# Altium schematic sheet УШЯИ687253.017Э3_3.SchDoc
size 420 x 297 mm; SheetNumber: 3; SheetTotal: 3
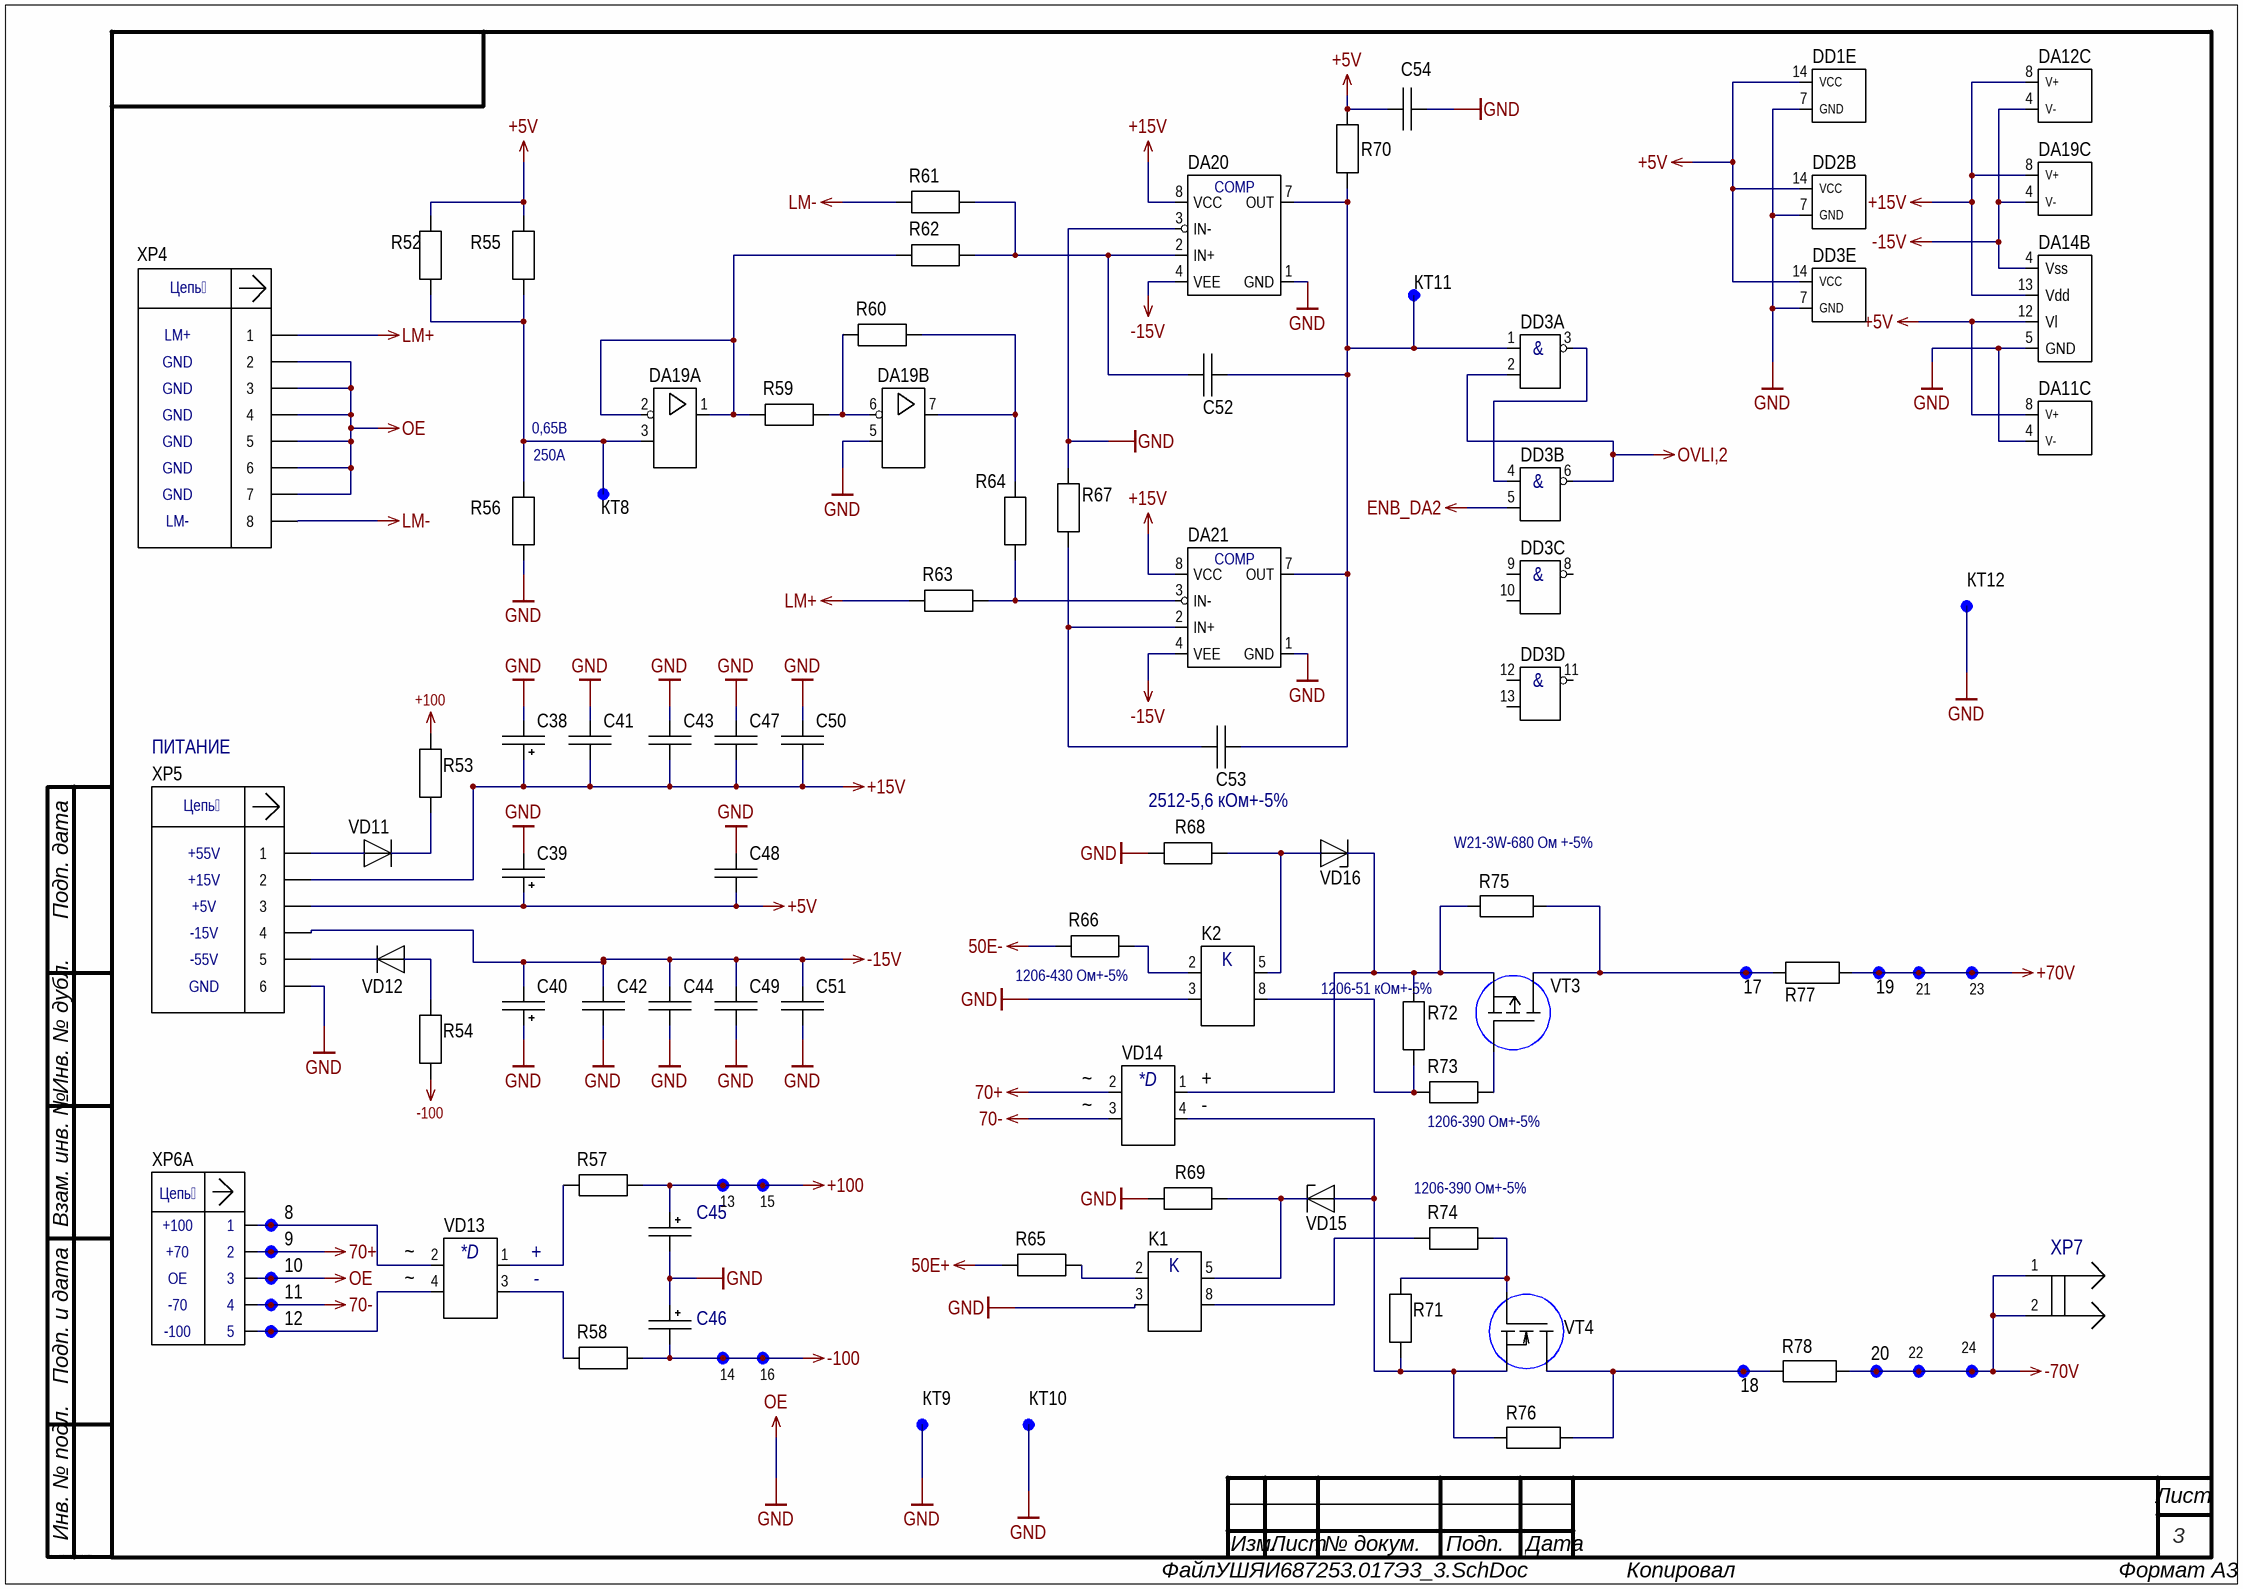
[diagram p0: УШЯИ687253.017Э3_3.SchDoc]

## Parts
8  OTV  (value not drawn)  (no BOM)
9  OTV  (value not drawn)  (no BOM)
10  OTV  (value not drawn)  (no BOM)
11  OTV  (value not drawn)  (no BOM)
12  OTV  (value not drawn)  (no BOM)
13  OTV13  [OTV13]  (value not drawn)  (no BOM)
14  OTV13  [OTV13]  (value not drawn)  (no BOM)
15  OTV13  [OTV13]  (value not drawn)  (no BOM)
16  OTV13  [OTV13]  (value not drawn)  (no BOM)
17  OTV  (value not drawn)  (no BOM)
18  OTV  (value not drawn)  (no BOM)
19  OTV  (value not drawn)  (no BOM)
20  OTV  (value not drawn)  (no BOM)
21  OTV13  [OTV13]  (value not drawn)  (no BOM)
22  OTV13  [OTV13]  (value not drawn)  (no BOM)
23  OTV13  [OTV13]  (value not drawn)  (no BOM)
24  OTV13  [OTV13]  (value not drawn)  (no BOM)
C38  ECR4R7M50B  [CAP TH ALUM ELEC D5.00mm S2.00mm H11.00mm]  (value not drawn)
C39  ECR4R7M50B  [CAP TH ALUM ELEC D5.00mm S2.00mm H11.00mm]  (value not drawn)
C40  ECR4R7M50B  [CAP TH ALUM ELEC D5.00mm S2.00mm H11.00mm]  (value not drawn)
C41  0805-X7R-25 В-0,33 мкФ +-10%  [CAP: 0805]  (value not drawn)
C42  0805-X7R-25 В-0,33 мкФ +-10%  [CAP: 0805]  (value not drawn)
C43  0805-X7R-25 В-0,33 мкФ +-10%  [CAP: 0805]  (value not drawn)
C44  0805-X7R-25 В-0,33 мкФ +-10%  [CAP: 0805]  (value not drawn)
C45  KM220M2EBKJ1020VBK  [CAP TH ALUM ELEC D10.00mm S5.00mm H20.00mm]  (value not drawn)
C46  KM220M2EBKJ1020VBK  [CAP TH ALUM ELEC D10.00mm S5.00mm H20.00mm]  (value not drawn)
C47  0805-X7R-25 В-0,33 мкФ +-10%  [CAP: 0805]  (value not drawn)
C48  0805-X7R-25 В-0,33 мкФ +-10%  [CAP: 0805]  (value not drawn)
C49  0805-X7R-25 В-0,33 мкФ +-10%  [CAP: 0805]  (value not drawn)
C50  0805-X7R-25 В-0,33 мкФ +-10%  [CAP: 0805]  (value not drawn)
C51  0805-X7R-25 В-0,33 мкФ +-10%  [CAP: 0805]  (value not drawn)
C52  1206-X7R-50 B-22 пФ+-10%  [CAP: 1206]  (value not drawn)
C53  1206-X7R-50 B-22 пФ+-10%  [CAP: 1206]  (value not drawn)
C54  0805-X7R-25 В-0,33 мкФ +-10%  [CAP: 0805]  (value not drawn)
DA11  ADA4084-2ARZ  [8-SOIC]  (value not drawn)  (part C of 3)
DA12  ADA4084-2ARZ  [8-SOIC]  (value not drawn)  (part C of 3)
DA14  ADG433BR  [16-SOIC]  (value not drawn)  (part B of 2)
DA19  ADA4084-2ARZ  [8-SOIC]  (value not drawn)  (parts A,B,C of 3)
DA20  IL311D  [8-SOIC]  (value not drawn)
DA21  IL311D  [8-SOIC]  (value not drawn)
DD1  IN74HC00AD  [14-soic]  (value not drawn)  (part E of 5)
DD2  IN74HC20D  [14-SOIC]  (value not drawn)  (part B of 2)
DD3  IN74HC00AD  [14-soic]  (value not drawn)  (parts A,B,C,D,E of 5)
K1  TLP3549F  [8-DIP]  (value not drawn)
K2  TLP3549F  [8-DIP]  (value not drawn)
R52  1206-15 кОм+-5%  [1206]  (value not drawn)
R53  1206-12 кОм+-5%  [1206]  (value not drawn)
R54  1206-12 кОм+-5%  [1206]  (value not drawn)
R55  1206-6,98 кОм+-1%  [1206]  (value not drawn)
R56  1206-1 кОм+-5%  [1206]  (value not drawn)
R57  2512-1,2 кОм+-5%  [2512]  (value not drawn)
R58  2512-1,2 кОм+-5%  [2512]  (value not drawn)
R59  1206-2 кОм+-0.5%  [1206]  (value not drawn)
R60  1206-2 кОм+-0.5%  [1206]  (value not drawn)
R61  1206-240 Ом+-5%  [1206]  (value not drawn)
R62  1206-240 Ом+-5%  [1206]  (value not drawn)
R63  1206-240 Ом+-5%  [1206]  (value not drawn)
R64  1206-240 Ом+-5%  [1206]  (value not drawn)
R65  1206-430 Ом+-5%  [1206]  (value not drawn)
R66  1206-430 Ом+-5%  [1206]
R67  1206-150 Ом+-5%  [1206]  (value not drawn)
R68  2512-5,6 кОм+-5%  [2512]
R69  2512-5,6 кОм+-5%  [2512]  (value not drawn)
R70  1206-2 кОм+-5%  [1206]  (value not drawn)
R71  1206-51 кОм+-5%  [1206]  (value not drawn)
R72  1206-51 кОм+-5%  [1206]
R73  1206-390 Ом+-5%  [1206]
R74  1206-390 Ом+-5%  [1206]
R75  W21-3W-680 Ом +-5%  [С2-33Н-0,25АИ (220.03.0401.00.00)]
R76  W21-3W-680 Ом +-5%  [С2-33Н-0,25АИ (220.03.0401.00.00)]  (value not drawn)
R77  HS15-4R7-J  [HS15]  (value not drawn)
R78  HS15-4R7-J  [HS15]  (value not drawn)
VD11  1N4007WS  [SOD-323]  (value not drawn)
VD12  1N4007WS  [SOD-323]  (value not drawn)
VD13  W04M  [WOM]  (value not drawn)
VD14  GSIB2540  [GSIB-5S]  (value not drawn)
VD15  BZT52C10  [SOD-123F]  (value not drawn)
VD16  BZT52C10  [SOD-123F]  (value not drawn)
VT3  IRF5210PBF  [TO-220(F)]  (value not drawn)
VT4  IPA083N10N5XKSA1  [TO-220(f)]  (value not drawn)
XP4  280373-2  [280373-2]  (value not drawn)
XP5  280372-2  [280372-2]  (value not drawn)
XP6  MNL-350810-1  [350810-1]  (value not drawn)  (part A of 3)
XP7  XT60-M  [AMASS_XT60-M]  (value not drawn)
КТ8  Лепесток  [LEPESTOK7750224]  (value not drawn)
КТ9  Лепесток  [LEPESTOK7750224]  (value not drawn)
КТ10  Лепесток  [LEPESTOK7750224]  (value not drawn)
КТ11  Лепесток  [LEPESTOK7750224]  (value not drawn)
КТ12  Лепесток  [LEPESTOK7750224]  (value not drawn)

## Nets
50E+: R65.1
50E-: R66.2
70+: 9.?1 VD14.2 XP6.2
70-: 11.?1 VD14.3 XP6.4
+5V: C39.1 C48.2 C54.1 DA11.8(V+) DA14.12(Vl) DD1.14(VCC) DD2.14(VCC) DD3.14(VCC) R52.2 R55.2 R70.2 XP5.3
+15V: C38.1 C41.1 C43.2 C47.2 C50.2 DA12.8(V+) DA14.13(Vdd) DA19.8(V+) DA20.8(VCC) DA21.8(VCC) XP5.2
+70V: 19.?1 21.1 23.1 R77.1
+100: 13.1 15.1 C45.1 R53.2 R57.2
-15V: C40.2 C42.1 C44.1 C49.1 C51.1 DA12.4(V-) DA14.4(Vss) DA19.4(V-) DA20.4(VEE) DA21.4(VEE) XP5.4
-70V: 20.?1 22.1 24.1 R78.2 XP7.1 XP7.2
-100: 14.1 16.1 C46.2 R54.2 R58.2
ENB_DA2: DD3.5(B2)
GND: 10.?1 C38.2 C39.2 C40.1 C41.2 C42.2 C43.1 C44.2 C45.2 C46.1 C47.1 C48.1 C49.2 C50.1 C51.2 C54.2 DA11.4(V-) DA14.5(GND) DA19.5(+IN_B) DA20.1(GND) DA20.3(IN-) DA21.1(GND) DD1.7(GND) DD2.7(GND) DD3.7(GND) K1.3(KATHODE) K2.3(KATHODE) R56.1 R67.2 R68.1 R69.1 XP4.2 XP4.3 XP4.4 XP4.5 XP4.6 XP4.7 XP5.6 XP6.3 КТ9.1 КТ10.1 КТ12.1  [also labelled OE]
LM+: R63.2 XP4.1
LM-: R61.1 XP4.8
OVLI,2: DD3.2(B1) DD3.6(Y2)
Net8_?1: 8.?1 VD13.2 XP6.1
Net12_?1: 12.?1 VD13.4 XP6.5
Net17_?1: 17.?1 R75.2 R77.2 VT3.2(D)
Net18_?1: 18.?1 R76.2 R78.1 VT4.2(D)
NetC52_1: C52.1 C53.2 DA20.7(OUT) DA21.7(OUT) DD3.1(A1) R70.1 КТ11.1
NetC52_2: C52.2 DA20.2(IN+) R61.2 R62.2
NetC53_1: C53.1 DA21.2(IN+) R67.1
NetDA19_1: DA19.1(OUT_A) DA19.2(-IN_A) R59.1 R62.1
NetDA19_3: DA19.3(+IN_A) R52.1 R55.1 R56.2 КТ8.1
NetDA19_6: DA19.6(-IN_B) R59.2 R60.1
NetDA19_7: DA19.7(OUT_B) R60.2 R64.2
NetDA21_3: DA21.3(IN-) R63.1 R64.1
NetDD3_3: DD3.3(Y1) DD3.4(A2)
NetK1_2: K1.2(ANOD) R65.2
NetK1_5: K1.5(DRAIN) R69.2 VD15.1(K)
NetK1_8: K1.8(DRAIN) R74.1
NetK2_2: K2.2(ANOD) R66.1
NetK2_5: K2.5(DRAIN) R68.2 VD16.2(A)
NetK2_8: K2.8(DRAIN) R72.1 R73.1
NetR53_1: R53.1 VD11.1
NetR54_1: R54.1 VD12.2
NetR57_1: R57.1 VD13.1(+)
NetR58_1: R58.1 VD13.3(-)
NetR71_1: R71.1 R76.1 VD14.4 VD15.2(A) VT4.3(S)
NetR71_2: R71.2 R74.2 VT4.1(G)
NetR72_2: R72.2 R75.1 VD14.1 VD16.1(K) VT3.3(S)
NetR73_2: R73.2 VT3.1(G)
NetVD11_2: VD11.2 XP5.1
NetVD12_1: VD12.1 XP5.5

Not connected (* = marked no-connect by the designer): DD3 8(Y3) 9(A3) 10(B3) 11(Y4) 12(A4) 13(B4)

## Notes on the sheet
- LM+
- GND
- 0,65В
- 250А
- LM-
- ПИТАНИЕ
- +55V
- +15V
- +5V
- -15V
- -55V
- (near VD14) ~
- (near VD14) +
- (near VD14) -
- +100
- +70
- OE
- (near XP6) 1
- (near XP6) 2
- (near XP6) 3
- (near VD13) ~
- (near VD13) -
- (near VD13) +
- -70
- -100
- (near XP6) 4
- (near XP6) 5
- Подп. дата
- Инв. № дубл.
- Взам. инв. №
- Подп. и дата
- Инв. № подл.
- Изм.
- Лист
- № докум.
- Подп.
- Дата
- ALTIUM GOSTBOM2.0 KEV
- Файл:
- Копировал
- Формат А3
- (in symbol 280372-2) Цепь
- (in symbol 280373-2) Цепь
- (in symbol GSIB2540) *D
- (in symbol IL311D) COMP
- (in symbol IN74HC00AD, part A) &
- (in symbol IN74HC00AD, part B) &
- (in symbol IN74HC00AD, part C) &
- (in symbol IN74HC00AD, part D) &
- (in symbol MNL-350810-1, part A) Цепь
- (in symbol TLP3549F) K
- (in symbol W04M) *D

## Library data of the parts
C38-C40 = ECR4R7M50B: Value: 4,7 мкФ
C45 C46 = KM220M2EBKJ1020VBK: KM220M2EBKJ1020VBK, 22uF, 105C,10x20; Value: *
C52 C53 = 1206-X7R-50 B-22 пФ+-10%: Value: 2,2 пФ
DA11 DA12 DA19 = ADA4084-2ARZ: 30 V, Low Noise, Rail-to-Rail Input/Output, / Low Power Operational Amplifiers
DA14 = ADG433BR_1: LC2MOS Precision Quad SPST Switches; Value: *
DA20 DA21 = IL311D: High Perfomance Voltage Comparartor; Value: *
DD1 DD3 = IN74HC00AD: Quad 2-Input NAND Gate High-Performance Silicon-Gate CMOS.
DD2 = IN74HC20D_1: Dual 4-input  NAND Gate CMOS
R52 = 1206-15 кОм+-5%: Value: 15 кОм; ModelPrint: 1206
R53 R54 = 1206-12 кОм+-5%: Value: 12 кОм; ModelPrint: 1206
R56 = 1206-1 кОм+-5%: Value: 1 кОм; ModelPrint: 1206
R57 R58 = 2512-1,2 кОм+-5%: Value: 1,2 кОм; ModelPrint: 2512
R59 R60 = 1206-2 кОм+-0.5%: Value: 2 кОм; ModelPrint: 1206
R61-R64 = 1206-240 Ом+-5%: Value: 240 Ом; ModelPrint: 1206
R65 R66 = 1206-430 Ом+-5%: Value: 430 Ом; ModelPrint: 1206
R67 = 1206-150 Ом+-5%: Value: 150 Ом; ModelPrint: 1206
R68 R69 = 2512-5,6 кОм+-5%: Value: 5,6 кОм; ModelPrint: 2512
R70 = 1206-2 кОм+-5%: Value: 2 кОм; ModelPrint: 1206
R71 R72 = 1206-51 кОм+-5%: Value: 51 кОм; ModelPrint: 1206
R73 R74 = 1206-390 Ом+-5%: Value: 390 Ом; ModelPrint: 1206
R75 R76 = W21-3W-680 Ом +-5%: Номинальная мощность рассеяния: 0,125 Вт; Диапазон значений номинальных сопротивлений: от 1 Ом до 3,01 МОм; Ряд сопротивлений: Е24, Е96; Категории качества: «ОТК»; ТУ: ОЖО.467.173 ТУ; Value: *
R77 R78 = HS15-4R7-J: Номинальная мощность рассеяния: 0,25 Вт; Диапазон значений номинальных сопротивлений: от 0,1 Ом до 3,01 МОм; Ряд сопротивлений: Е24, Е96; Категории качества: «ОТК»; ТУ: ОЖО.467.173 ТУ; Value: 4,7 Ом
VD11 VD12 = 1N4007WS: General Purpose Plastic Rectifier; Value: *
VD13 = W04M: Диод W04M
VD14 = GSIB2540: Диод GSIB2540
VD15 VD16 = BZT52C10: Стабилитрон BZT52C10; Value: *
VT4 = IPA083N10N5XKSA1: Single N-Channel 100 V 8.3 mOhm 37 nC OptiMOS Power Mosfet - TO-220-3
XP4 = 280373-2: Connector; System: Connector
XP5 = 280372-2: Connector; System: Connector
XP6 = MNL-350810-1: System: Connector
XP7 = XT60-M: Plug; DC supply; XT60; male; PIN: 2; for cable; soldered; 30A; 500V; MF: AMASS; SnapEDA_Link: https://www.snapeda.com/parts/XT60-M/AMASS/view-part/?ref=snap; Package: Package; Value: *; MP: XT60-M; Check_prices: https://www.snapeda.com/parts/XT60-M/AMASS/view-part/?ref=eda
КТ8-КТ12 = Lepestok
C41-C44 C47-C51 C54 = 0805-X7R-25 В-0,33 мкФ +-10%: Value: 0,33 мкФ
R55 = 1206-6,98 кОм+-1%: Value: 6,98 кОм; ModelPrint: 1206